# Altium schematic sheet DRV8323RSRGZR.SchDoc
size A3; SheetNumber: 3; SheetTotal: 6
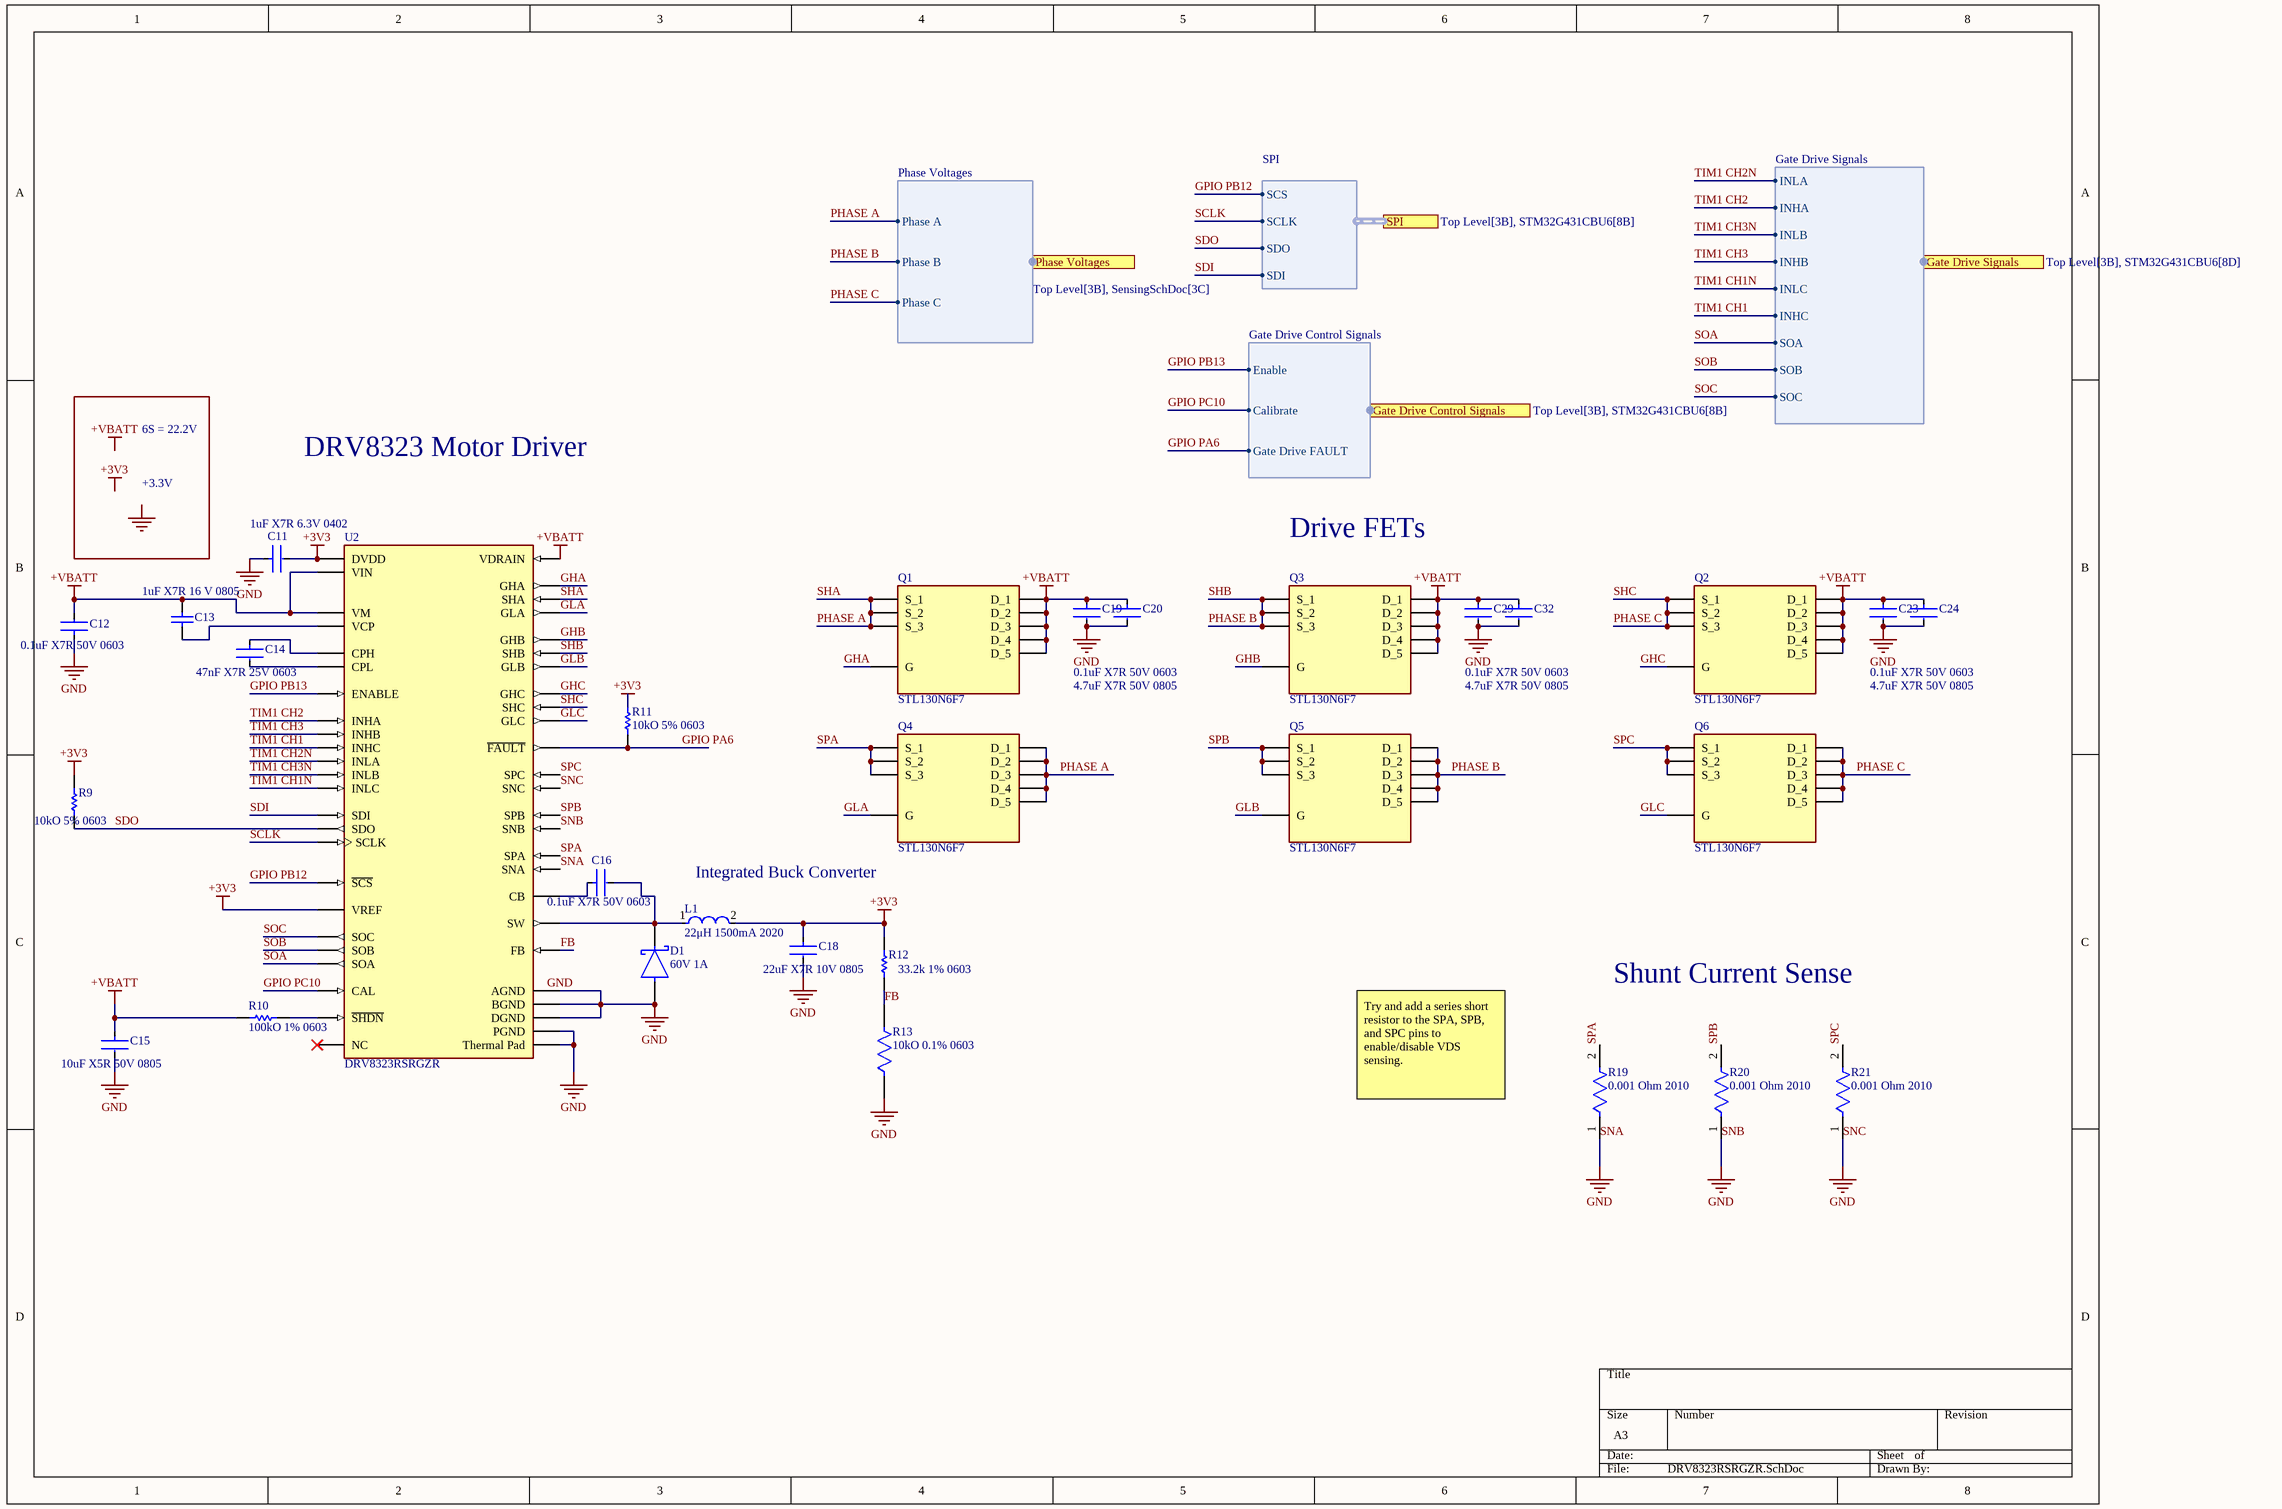
[diagram p0: DRV8323RSRGZR.SchDoc]

## Parts
C11  1uF X7R 6.3V 0402  [FP-GRT155-0_05-IPC_C]
C12  0.1uF X7R 50V 0603  [FP-0603B104K500CT-IPC_C]
C13  1uF X7R 16 V 0805  [CAPC2013X140X50NL20T25]
C14  47nF X7R 25V 0603  [FP-C0603C-CF-MFG]
C15  10uF X5R 50V 0805  [FP-GRM21B-0_2-e0_2_0_7-IPC_A]
C16  0.1uF X7R 50V 0603  [FP-0603B104K500CT-IPC_C]
C18  22uF X7R 10V 0805  [FP-GRM21B-0_2-e0_2_0_7-MFG]
C19  0.1uF X7R 50V 0603  [FP-0603B104K500CT-IPC_C]
C20  4.7uF X7R 50V 0805  [FP-GRM21B-0_2-e0_2_0_7-MFG]
C23  0.1uF X7R 50V 0603  [FP-0603B104K500CT-IPC_C]
C24  4.7uF X7R 50V 0805  [FP-GRM21B-0_2-e0_2_0_7-MFG]
C29  0.1uF X7R 50V 0603  [FP-0603B104K500CT-IPC_C]
C32  4.7uF X7R 50V 0805  [FP-GRM21B-0_2-e0_2_0_7-MFG]
D1  60V 1A  [FP-SMA-MFG]
L1  22μH 1500mA 2020  [FP-LQH5BPN_38-MFG]
Q1  STL130N6F7  [FERD20U50DJFTR]
Q2  STL130N6F7  [FERD20U50DJFTR]
Q3  STL130N6F7  [FERD20U50DJFTR]
Q4  STL130N6F7  [FERD20U50DJFTR]
Q5  STL130N6F7  [FERD20U50DJFTR]
Q6  STL130N6F7  [FERD20U50DJFTR]
R9  10kO 5% 0603  [RESC1608X55X25LL10T15]
R10  100kO 1% 0603  [RESC1608X55X25ML10T15]
R11  10kO 5% 0603  [RESC1608X55X25LL10T15]
R12  33.2k 1% 0603  [RESC1608X55X25NL10T15]
R13  10kO 0.1% 0603  [FP-RT0603-MFG]
R19  0.001 Ohm 2010  [FP-WSL2010-1_47-MFG]
R20  0.001 Ohm 2010  [FP-WSL2010-1_47-MFG]
R21  0.001 Ohm 2010  [FP-WSL2010-1_47-MFG]
U2  DRV8323RSRGZR  [FP-RGZ0048A-MFG]

## Ports
Gate Drive Control Signals (harness Gate Drive Control Signals, see Top Level[3B], STM32G431CBU6[8B]), Gate Drive Signals (harness Gate Drive Signals, see Top Level[3B], STM32G431CBU6[8D]), Phase Voltages (harness Phase Voltages, see Top Level[3B], SensingSchDoc[3C]), SPI (harness SPI, see Top Level[3B], STM32G431CBU6[8B])

## Harnesses
SPI: SCLK, SDO, SDI, SCS
Phase Voltages: Phase A, Phase B, Phase C
Gate Drive Control Signals: Enable, Calibrate, Gate Drive FAULT
Gate Drive Signals: INLA, INHA, INLB, INHB, INLC, INHC, SOA, SOB, SOC

## Nets
+3V3: C11.2 C18.1 L1.2 R9.2 R11.2 R12.2 U2.26(VREF) U2.36(DVDD)
+VBATT: C12.2 C13.1 C15.1 C19.1 C20.1 C23.1 C24.1 C29.1 C32.1 Q1.5(D_1) Q1.6(D_2) Q1.7(D_3) Q1.8(D_4) Q1.9(D_5) Q2.5(D_1) Q2.6(D_2) Q2.7(D_3) Q2.8(D_4) Q2.9(D_5) Q3.5(D_1) Q3.6(D_2) Q3.7(D_3) Q3.8(D_4) Q3.9(D_5) R10.2 U2.6(VM) U2.7(VDRAIN) U2.47(VIN)
SNA: C11.1 C12.1 C15.2 C18.2 C19.2 C20.2 C23.2 C24.2 C29.2 C32.2 D1.2(A) R13.1 R19.1 R20.1 R21.1 U2.2(PGND) U2.12(SNA) U2.13(SNB) U2.22(SNC) U2.27(DGND) U2.35(AGND) U2.43(BGND) U2.49(Thermal_Pad)  [also labelled GND, SNB, SNC]
FB: R12.1 R13.2 U2.1(FB)
GHA: Q1.4(G) U2.8(GHA)
GHB: Q3.4(G) U2.17(GHB)
GHC: Q2.4(G) U2.18(GHC)
GLA: Q4.4(G) U2.10(GLA)
GLB: Q5.4(G) U2.15(GLB)
GLC: Q6.4(G) U2.20(GLC)
GPIO PA6: R11.1 U2.28(~{FAULT}) ; port Gate Drive Control Signals.Gate Drive FAULT
GPIO PB12: U2.32(~{SCS}) ; port SPI.SCS
GPIO PB13: U2.33(ENABLE) ; port Gate Drive Control Signals.Enable
GPIO PC10: U2.34(CAL) ; port Gate Drive Control Signals.Calibrate
PHASE A: Q1.1(S_1) Q1.2(S_2) Q1.3(S_3) Q4.5(D_1) Q4.6(D_2) Q4.7(D_3) Q4.8(D_4) Q4.9(D_5) U2.9(SHA) ; port Phase Voltages.Phase A  [also labelled SHA]
PHASE B: Q3.1(S_1) Q3.2(S_2) Q3.3(S_3) Q5.5(D_1) Q5.6(D_2) Q5.7(D_3) Q5.8(D_4) Q5.9(D_5) U2.16(SHB) ; port Phase Voltages.Phase B  [also labelled SHB]
PHASE C: Q2.1(S_1) Q2.2(S_2) Q2.3(S_3) Q6.5(D_1) Q6.6(D_2) Q6.7(D_3) Q6.8(D_4) Q6.9(D_5) U2.19(SHC) ; port Phase Voltages.Phase C  [also labelled SHC]
SCLK: U2.31(SCLK) ; port SPI.SCLK
SDI: U2.30(SDI) ; port SPI.SDI
SDO: R9.1 U2.29(SDO) ; port SPI.SDO
SOA: U2.25(SOA) ; port Gate Drive Signals.SOA
SOB: U2.24(SOB) ; port Gate Drive Signals.SOB
SOC: U2.23(SOC) ; port Gate Drive Signals.SOC
SPA: Q4.1(S_1) Q4.2(S_2) Q4.3(S_3) R19.2 U2.11(SPA)
SPB: Q5.1(S_1) Q5.2(S_2) Q5.3(S_3) R20.2 U2.14(SPB)
SPC: Q6.1(S_1) Q6.2(S_2) Q6.3(S_3) R21.2 U2.21(SPC)
TIM1 CH1: U2.41(INHC) ; port Gate Drive Signals.INHC
TIM1 CH1N: U2.42(INLC) ; port Gate Drive Signals.INLC
TIM1 CH2: U2.37(INHA) ; port Gate Drive Signals.INHA
TIM1 CH2N: U2.38(INLA) ; port Gate Drive Signals.INLA
TIM1 CH3: U2.39(INHB) ; port Gate Drive Signals.INHB
TIM1 CH3N: U2.40(INLB) ; port Gate Drive Signals.INLB
NetC13_2: C13.2 U2.5(VCP)
NetC14_1: C14.1 U2.4(CPH)
NetC14_2: C14.2 U2.3(CPL)
NetC16_1: C16.1 U2.44(CB)
NetC16_2: C16.2 D1.1(C) L1.1 U2.45(SW)
NetR10_1: R10.1 U2.48(~{SHDN})

Not connected (* = marked no-connect by the designer): U2 46(NC)*

## Notes on the sheet
- 6S = 22.2V
- +3.3V
- DRV8323 Motor Driver
- Drive FETs
- Integrated Buck Converter
- Shunt Current Sense
- Try and add a series short resistor to the SPA, SPB, and SPC pins to enable/disable VDS sensing.
- Labels drawn without touching a wire or pin: +3V3, +VBATT, GND

## Library data of the parts
C11 = CMP-06035-034802-1: Multi-Layer Ceramic Capacitor 1uF 6.3V X7R ±10% 0402 Paper T/R
C12 C16 C19 C23 C29 = CMP-45632-000007-1: CAP CER 0.1UF 50V X7R 0603; Tolerance: 10%; Capacitance: 100nF; Radiation Hardening: No; Depth: 0.8mm; Length: 1.6mm; Voltage Rating: 50V; Dielectric: X7R; Case/Package: 0603; RoHS Compliant: Yes; Case Code (Metric): 1608; Voltage Rating (DC): 50V; Min Operating Temperature: -55°C; Series: -; Max Operating Temperature: 125°C; Lead Free: Lead Free; Case Code (Imperial): 0603; Packaging: Tape and Reel
C13 = CMP-2007-03229-1: Part Number: C0805C105J4RACTU; Manufacturer: Kemet
C14 = CMP-2006-03882-2: CAP CER 0.047UF 25V 10% X7R 0603; Manufacturer: KEMET; Manufacturer Part Number: C0603C473K3RACTU; Capacitance: 47,000 pF; Temperature Coefficient: 30ppm/°C; Material: Ceramic; Tolerance: 0.1; Value: 47,000 pF; Automotive Grade: Grade 1; Height: 0.87mm; Voltage Rating: 25 V; Automotive: Yes; Device Class L3: Ceramic Capacitors; Device Class L2: Capacitors; Mouser Description: Multilayer Ceramic Capacitor, C Series, 0.047 - F, - 10%, X7R, 25 V, 0603 [1608 Metric] Rohs Compliant: Yes; Digikey Description: CAP CER 0.047UF 25V 10% X7R 0603; Temperature Characteristic: X7R; Package: C0603C-CF; Device Class L1: Passive Components; Temperature: -55°C to +125°C; Octopart: https://octopart.com/c0603c473k3ractu-kemet-3834514; RoHS: TRUE; ComponentLink2Description: Datasheet; Temperature Range Low: -55°C; Temperature Range High: +125°C; Category: Cap; ComponentLink2URL: https://api.kemet.com/component-edge/download/datasheet/C0603C100J5GACAUTO.pdf; Lead Free: Yes
C15 = CMP-06035-004402-1: Chip Multilayer Ceramic Capacitors for General Purpose, 0805, 10uF, X5R, 15%, 10%, 50V; Voltage Rating (DC): 50V; Dielectric: X5R; Tolerance: 10%; Capacitance: 10uF; Thickness: 1.25mm; Length: 2mm; Width: 1.25mm
C18 = CMP-06035-051066-1: Chip Multilayer Ceramic Capacitors for General Purpose, 0805, 22uF, X7R, 15%, 20%, 10V
C20 C24 C32 = CMP-06035-012295-1: Chip Multilayer Ceramic Capacitors for General Purpose, 0805, 4.7uF, X7R, 15%, 20%, 50V
D1 = CMP-2000-05885-2: DIODE SCHOTTKY 60V 1A SMA; Polarity: Standard; Element Configuration: Single; Peak Reverse Current: 500uA; Capacitance: 110pF; Peak Non-Repetitive Surge Current: 30A; Forward Voltage: 700mV; Termination: SMD/SMT; Radiation Hardening: No; Number of Pins: 2; Packaging: Tape and Reel; Length: 4.6mm; Current Rating: 1A; Lead Free: Lead Free; Output Current: 1A; Max Operating Temperature: 150°C; Min Operating Temperature: -65°C; Forward Current: 1A; Mount: Surface Mount; Width: 2.92mm; Average Rectified Current: 1A; Max Forward Surge Current (Ifsm): 30A; Voltage Rating (DC): 60V; Height: 2.1mm; REACH SVHC: No SVHC; Max Reverse Voltage (DC): 60V; Max Repetitive Reverse Voltage (Vrrm): 60V; Weight: 0.002258oz; Contact Plating: Tin; Case/Package: SMA; Package Quantity: 5000
L1 = CMP-06042-012393-1: Wire Wound Ferrite Inductor for Power Lines 22μH ±20% 0.132Ω 1500mA 2020 / LQH5BPN220M38L
Q1-Q6 = STL130N6F7: MOSFET (N-Channel); Manufacturer_Name: STMicroelectronics; Datasheet Link: https://www.st.com/resource/en/datasheet/stl130n6f7.pdf; Height: 1mm; Manufacturer_Part_Number: STL130N6F7; Mouser Part Number: 511-STL130N6F7; Mouser Price/Stock: https://www.mouser.co.uk/ProductDetail/STMicroelectronics/STL130N6F7?qs=bKenfurwlsn66DUeXqgWIw%3D%3D; Arrow Part Number: STL130N6F7; Arrow Price/Stock: https://www.arrow.com/en/products/stl130n6f7/stmicroelectronics?utm_currency=USD&region=nac
R9 R11 = CMP-2000-04303-1: Manufacturer: Yageo; Part Number: RC0603JR-1010KL
R10 = CMP-2000-04193-1: Manufacturer: Yageo; Part Number: RC0603FR-13100KL
R12 = CMP-1659-00059-1: Chip Resistor, 33.2 KOhm, +/- 1%, 100 mW, -55 to 155 degC, 0603 (1608 Metric), RoHS, Tape and Reel; Tolerance: 20ppm; Capacitance: 1.8E-11 f; Resistance: 70 Ohm; Frequency: 12 MHz; Load Capacitance: 18 pF; Length: 0.197 inch; Min Operating Temperature: -20degC; PackageReference: 0603; ComponentLink2URL: http://www.yageo.com/documents/recent/PYu-RC_Group_51_RoHS_L_04.pdf; Radiation Hardening: No; Package Quantity: 1000; Height: 0.043 inch; Packaging: Tape and Reel; ComponentLink1URL: http://www.yageo.com/; PackageDescription: 2-Pin Surface Mount Device, Body 1.6 x 0.8 mm; Max Operating Temperature: 70degC; ComponentLink1Description: Manufacturer URL; DatasheetVersion: Rev. 4, 02/2016; Width: 0.126 inch; ComponentLink2Description: Datasheet; Frequency Tolerance: 20ppm; Case/Package: CSMD; Pins: 4; RoHSCompliant: True; ESR: 70 Ohm; REACH SVHC: No SVHC; Mount: Surface Mount
R13 = CMP-03412-009989-1: RES SMD 10K OHM 0.1% 1/10W 0603; Manufacturer: Yageo; Manufacturer Part Number: RT0603BRC0710KL; Tolerance: 0.001; Value: 10KΩ; Power Rating: 0.1W; Voltage Rating: 75V; Temperature Coefficient: 15 ppm/°C; Device Class L2: Resistors; Temperature: -55°C to +155°C; Device Class L3: Chip SMD Resistors; Series: RT; RoHS: TRUE; Category: Res; Composition: Thin Film; Temperature Range Low: -55°C; Resistance: 10KΩ; Temperature Range High: +155°C; Package: RT0603; Height: 0.55mm; Automotive: No; Device Class L1: Passive Components; Lead Free: Yes; Digikey Description: RES SMD 10K OHM 0.1% 1/10W 0603; Ipc Land Pattern Name: RESC16080X45; Octopart: https://octopart.com/rt0603brc0710kl-yageo-20648660; Footprint Url: http://www.yageo.com/exep/pages/download/literatures/PYu-R_Mount_10.pdf; ComponentLink2Description: Datasheet; ComponentLink2URL: http://www.yageo.com/documents/recent/PYu-RT_1-to-0.01_RoHS_L_9.pdf; Mouser Description: Res Thin Film 0603 10K Ohm 0.1% 1/10W ±15ppm/°C Molded SMD Paper T/R
R19-R21 = CMP-00030-39744854-1: WSL20101L000FEA18 Res Metal Strip 2010 0.001 Ohm 1% 1W ±275ppm/C Sulfur Resistant Pad SMD Automotive T/R; Resistance: 1mΩ; Temperature Coefficient: 275ppm/°C; Power Rating: 500mW; Max Power Dissipation: 1W; Features: Moisture Resistant; Number of Pins: 2010; Mount: Surface Mount; Radiation Hardening: No; Packaging: Cut Tape; REACH SVHC: Unknown; Tolerance: 1%; Depth: 2.54mm; Termination: SMD/SMT; NexarPartId: 39744854; Schedule B: 8533210045, 8533210045; Min Operating Temperature: -65°C; Contact Plating: Tin; Length: 5.08mm; Lead Free: Lead Free; Max Operating Temperature: 170°C; RoHS: Compliant; Case Code (Imperial): 2010; Width: 2.54mm; Case Code (Metric): 5025; Composition: Metal Element, Metal Strip; Height: 635µm; Number of Terminations: 2; Case/Package: 2010
U2 = CMP-04915-000002-1: IC MTR DRV MULTIPHAS 6-60V 48QFN; Manufacturer: Texas Instruments; Min Supply Voltage: 4V; Switching Frequency: 700kHz; Nominal Supply Current: 10.5mA; Max Supply Voltage: 60V; Standoff Height: 0mm; Motor Type: Brushless DC; Output Current: 5mA; Max Junction Temp: +150°C; Category: IC; Digikey Description: IC MTR DRV MULTIPHAS 6-60V 48QFN; Height: 1mm; Lead Free: Yes; Device Class L1: Integrated Circuits (ICs); ComponentLink2Description: Datasheet; Manufacturer Part Number: DRV8323RSRGZR; RoHS: TRUE; ComponentLink2URL: http://www.ti.com/lit/ds/symlink/drv8323r.pdf; Ambient Temperature Range Low: -40°C; Octopart: https://octopart.com/drv8323rsrgzr-texas+instruments-80665177; Ambient Temperature Range High: +125°C; Temperature Range Low: -40°C; Temperature Range High: +125°C; Device Class L3: Motor Drivers; Package: RGZ0048A; Automotive: No; Device Class L2: Power Management ICs; Temperature: -40°C to +125°C; Mouser Description: Triple Half Bridge Motor Driver 48-Pin VQFN EP T/R